# Altium project LimeSDR-XTRX_1v3.PrjPcb (part 6 of 8)

## Sheet 10_Clock.SchDoc: Clock
size A3; Organization: Lime Microsystems; Address1: Surrey Tech Centre; Address2: Guildford GU2 7YG; Address3: Surrey; Address4: United Kingdom; Revision: v1.3; SheetNumber: 10; SheetTotal: 11
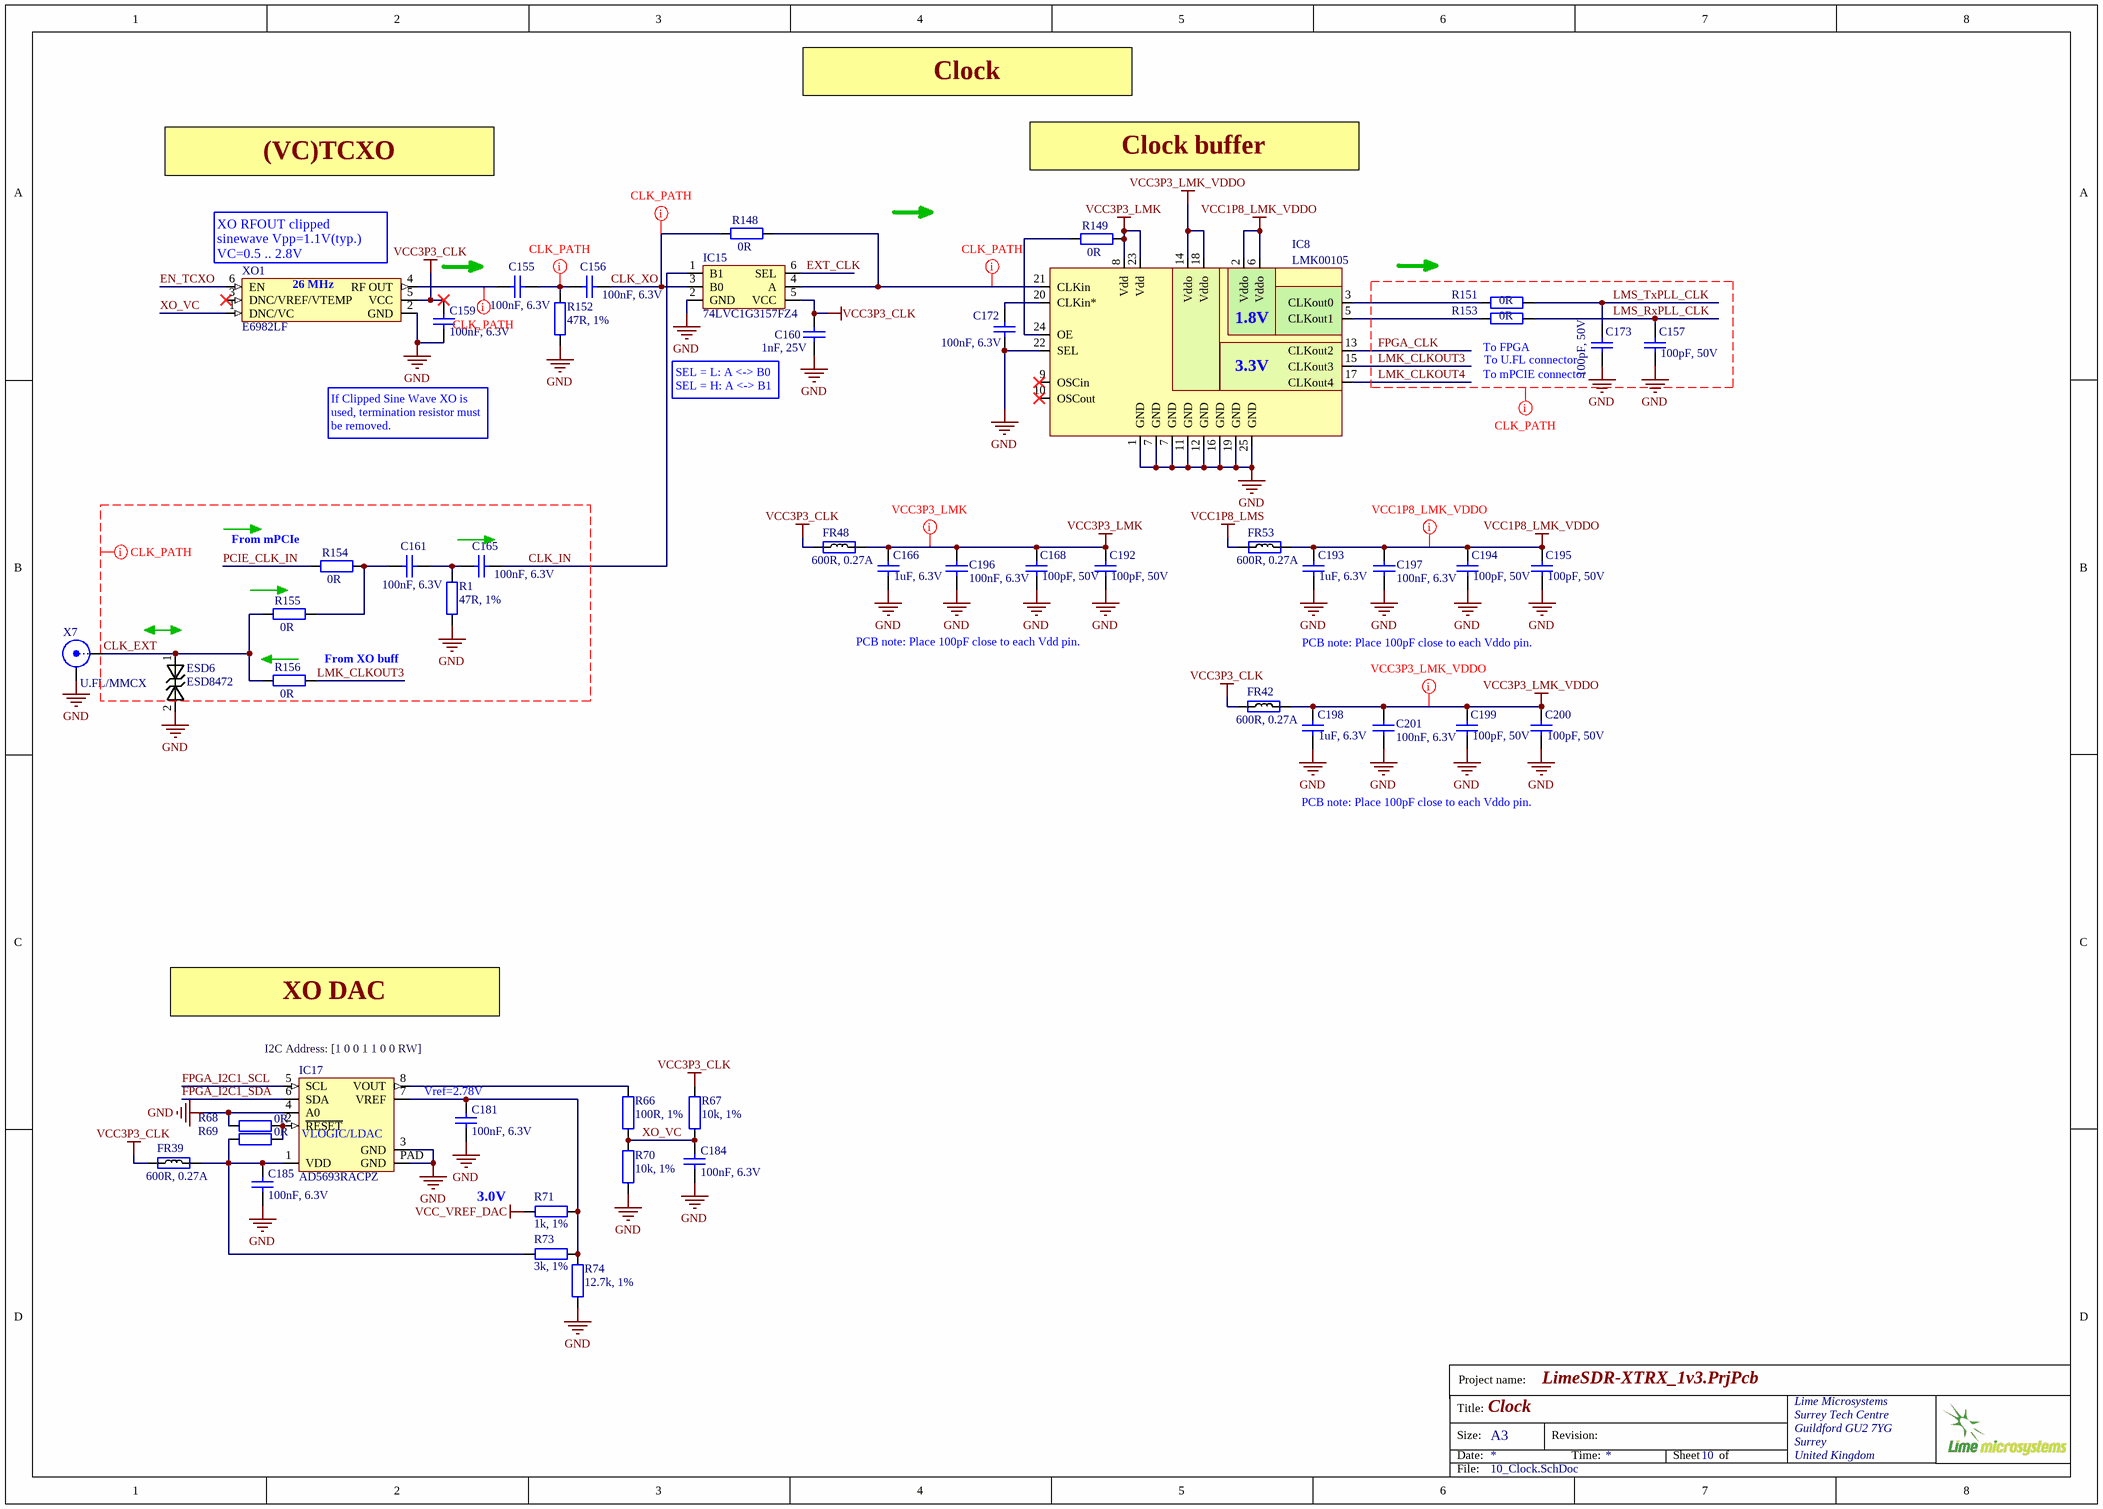
[diagram p9: 10_Clock.SchDoc]

### Parts
C155  100nF, 6.3V  [CAP0201]
C156  100nF, 6.3V  [CAP0201]
C157  100pF, 50V  [CAP0201]
C159  100nF, 6.3V  [CAP0201]
C160  1nF, 25V  [CAP0201]
C161  100nF, 6.3V  [CAP0201]
C165  100nF, 6.3V  [CAP0201]
C166  1uF, 6.3V  [CAP0201]
C168  100pF, 50V  [CAP0201]
C172  100nF, 6.3V  [CAP0201]
C173  100pF, 50V  [CAP0201]
C181  100nF, 6.3V  [CAP0201]
C184  100nF, 6.3V  [CAP0201]
C185  100nF, 6.3V  [CAP0201]
C192  100pF, 50V  [CAP0201]
C193  1uF, 6.3V  [CAP0201]
C194  100pF, 50V  [CAP0201]
C195  100pF, 50V  [CAP0201]
C196  100nF, 6.3V  [CAP0201]
C197  100nF, 6.3V  [CAP0201]
C198  1uF, 6.3V  [CAP0201]
C199  100pF, 50V  [CAP0201]
C200  100pF, 50V  [CAP0201]
C201  100nF, 6.3V  [CAP0201]
ESD6  ESD8472  [ESD8472_X3DFN2]
FR39  600R, 0.27A  [RES0201]
FR42  600R, 0.27A  [RES0201]
FR48  600R, 0.27A  [RES0201]
FR53  600R, 0.27A  [RES0201]
IC8  LMK00105  [LMK00105SQ_v2]
IC15  74LVC1G3157FZ4  [74LVC1G3157FZ4_SPDT_SW_DFN1410-6]
IC17  AD5693RACPZ  [AD5693RACPZ-1RL7_DAC_8LFCSP]
R1  47R, 1%  [RES0201]
R66  100R, 1%  [RES0201]
R67  10k, 1%  [RES0201]
R68  0R  [RES0201]
R69  0R  [RES0201]
R70  10k, 1%  [RES0201]
R71  1k, 1%  [RES0201]
R73  3k, 1%  [RES0201]
R74  12.7k, 1%  [RES0201]
R148  0R  [RES0201]
R149  0R  [RES0201]
R151  0R  [RES0201]
R152  47R, 1%  [RES0201]
R153  0R  [RES0201]
R154  0R  [RES0201]
R155  0R  [RES0201]
R156  0R  [RES0201]
X7  U.FL/MMCX  [MMCX_UFL_conn_u_v2]
XO1  E6982LF  [RAKON_E8231LF_E6982LF]

### Nets
GND: C157.1 C159.2 C160.1 C166.2 C168.1 C172.1 C173.1 C181.2 C184.2 C185.2 C192.1 C193.2 C194.1 C195.1 C196.1 C197.1 C198.2 C199.1 C200.1 C201.1 ESD6.2 IC8.1(GND) IC8.7(GND) IC8.11(GND) IC8.12(GND) IC8.16(GND) IC8.19(GND) IC8.22(SEL) IC8.25(GND) IC15.2(GND) IC17.3(GND) IC17.4(A0) IC17.PAD(GND) R1.2 R68.1 R70.2 R74.2 R152.2 X7.2(Y) XO1.2(GND)
VCC1P8_LMK_VDDO: C193.1 C194.2 C195.2 C197.2 FR53.2 IC8.2(Vddo) IC8.6(Vddo)
VCC1P8_LMS: FR53.1
VCC3P3_CLK: C159.1 C160.2 FR39.1 FR42.1 FR48.1 IC15.5(VCC) R67.1 XO1.5(VCC)
VCC3P3_LMK: C166.1 C168.2 C192.2 C196.2 FR48.2 IC8.8(Vdd) IC8.23(Vdd) R149.2
VCC3P3_LMK_VDDO: C198.1 C199.2 C200.2 C201.2 FR42.2 IC8.14(Vddo) IC8.18(Vddo)
VCC_VREF_DAC: R71.2
CLK_EXT: ESD6.1 R155.1 R156.1 X7.1(X)
CLK_IN: C165.2 IC15.1(B1)
CLK_XO: C156.2 IC15.3(B0) R148.1
EN_TCXO: XO1.6(EN)
EXT_CLK: IC15.6(SEL)
FPGA_CLK: IC8.13(CLKout2)
FPGA_I2C1_SCL: IC17.5(SCL)
FPGA_I2C1_SDA: IC17.6(SDA)
LMK_CLKOUT3: IC8.15(CLKout3) R156.2
LMK_CLKOUT4: IC8.17(CLKout4)
LMS_RxPLL_CLK: C157.2 R153.2
LMS_TxPLL_CLK: C173.2 R151.2
PCIE_CLK_IN: R154.1
XO_VC: C184.1 R66.2 R67.2 R70.1 XO1.1(DNC/VC)
NetC155_1: C155.1 C156.1 R152.1
NetC155_2: C155.2 XO1.4(RF_OUT)
NetC161_1: C161.1 C165.1 R1.1
NetC161_2: C161.2 R154.2 R155.2
NetC172_2: C172.2 IC8.20(CLKin*)
NetC181_1: C181.1 IC17.7(VREF) R71.1 R73.1 R74.1
NetC185_1: C185.1 FR39.2 IC17.1(VDD) R69.1 R73.2
NetIC8_3: IC8.3(CLKout0) R151.1
NetIC8_5: IC8.5(CLKout1) R153.1
NetIC8_21: IC8.21(CLKin) IC15.4(A) R148.2
NetIC8_24: IC8.24(OE) R149.1
NetIC17_2: IC17.2(~{RESET}) R68.2 R69.2
NetIC17_8: IC17.8(VOUT) R66.1

Not connected (* = marked no-connect by the designer): IC8 9(OSCin)* 10(OSCout)*; XO1 3(DNC/VREF/VTEMP)*

### Layout directives
net class CLK_PATH: CLK_EXT, CLK_IN, CLK_XO, FPGA_CLK, GND, LMK_CLKOUT3, LMK_CLKOUT4, LMS_RxPLL_CLK, LMS_TxPLL_CLK, NetC155_1, NetC155_2, NetIC8_21, PCIE_CLK_IN
net class VCC3P3_LMK: VCC3P3_LMK
net class VCC3P3_LMKRF: VCC1P8_LMK_VDDO
net class VCC3P3_LMK_VDDO: VCC3P3_LMK_VDDO

### Notes on the sheet
- Clock
- (VC)TCXO
- Clock buffer
- (near XO1) XO RFOUT clipped sinewave Vpp=1.1V(typ.)
  VC=0.5 .. 2.8V
- (near XO1) 26 MHz
- (near IC8) 3.3V
- (near IC8) 1.8V
- (near C173) To mPCIE connector
- (near R153) To FPGA
- (near C173) To U.FL connector
- If Clipped Sine Wave XO is used, termination resistor must be removed.
- SEL = L: A <-> B0
  SEL = H: A <-> B1
- (near R154) From mPCIe
- PCB note: Place 100pF close to each Vdd pin.
- PCB note: Place 100pF close to each Vddo pin.
- (near R156) From XO buff
- XO DAC
- (near IC17) I2C Address: [1 0 0 1 1 0 0 RW]
- (near C181) Vref=2.78V
- (near IC17) VLOGIC/LDAC
- (near R71) 3.0V
- Project name:
- Title:
- Size:
- Date:
- A3
- Revision:
- Time:
- Sheet
- of
- File:

### Library data of the parts
C155 C156 C161 C165 C172 C196 C197 C201 = Cap_0402: Part Description: 0.1 µF ±20% 10V Ceramic Capacitor X5R 0201 (0603 Metric); Manufacturer: Samsung; Manufacturer Part Number 1: CL03A104MP3NNNC; Tolerance: 20%; Voltage Rating (DC): 10V; Value: 100nF, 6.3V; Capacitance: 100nF; Case/Package: 0201; Case Code (Imperial): 0201; Case Code (Metric): 0603; ComponentLink5Description: https://datasheet.ciiva.com/25788/cl03a104mp3nnnc-25788272.pdf?src-supplier=Digi-Key; ComponentLink5URL: https://datasheet.ciiva.com/25788/cl03a104mp3nnnc-25788272.pdf?src-supplier=Digi-Key; Length: 0.024inch; Max Operating Temperature: 85°C; Min Operating Temperature: -55°C; Mount: Surface Mount; Package Quantity: 1; Packaging: Tape and Reel; Pricing 1: 1=0,10000, 10=0,03000, 50=0,01640, 100=0,01330, 500=0,00950, 1000=0,00747, 2500=0,00679, 5000=0,00625 (USD); RoHS: Yes; RoHS Compliant: Yes; Series: CL; Stock 1: 3817176; Supplier 1: Digi-Key; Supplier Part Number 1: 1276-1321-1-ND; Thickness: 0.013inch; Voltage Rating: 10V; Width: 0.012inch
C157 C168 C173 C192 C194 C195 C199 C200 = Cap_0402: Part Description: 100 pF ±5% 50V Ceramic Capacitor C0G, NP0 0201 (0603 Metric); Manufacturer: TDK; Manufacturer Part Number 1: C0603C0G1H101J030BA; Dielectric Material: Ceramic; Tolerance: 5%; Dielectric: C0G; Insulation Resistance: 10GR; Value: 100pF, 50V; Supplier 1: Digi-Key; Supplier Part Number 1: 445-1786-1-ND; Stock 1: 367528; Pricing 1: 1=0,10000, 10=0,06000, 50=0,03280, 100=0,02670, 500=0,01908, 1000=0,01500, 2500=0,01364, 5000=0,01254 (USD); RoHS: Yes; Mount: Surface Mount; Case/Package: 0201; Number of Pins: 2; Case Code (Metric): 0603; Case Code (Imperial): 0201; Weight: 6E-06oz; Min Operating Temperature: -55°C; Max Operating Temperature: 125°C; Package Quantity: 1; Capacitance: 100pF; Voltage Rating: 50V; Packaging: Tape and Reel; Voltage Rating (DC): 50V; Termination: SMD/SMT; Voltage: 50V; Series: C; Construction: Flat; Length: 0.6mm; Width: 0.012inch; Height: 0.3mm; Thickness: 0.013inch; Depth: 0.3mm; Reach SVHC Compliant: Yes; Lead Free: Lead Free; RoHS Compliant: Yes; ComponentLink1URL: https://datasheet.ciiva.com/24217/c0603c0g1h101j030ba-264106-24217425.pdf?src-supplier=Mouser; ComponentLink1Description: https://datasheet.ciiva.com/24217/c0603c0g1h101j030ba-264106-24217425.pdf?src-supplier=Mouser; ComponentLink2URL: https://datasheet.ciiva.com/16205/mlcc-commercial-general-en-16205590.pdf?src-supplier=Future+Electronics; ComponentLink2Description: https://datasheet.ciiva.com/16205/mlcc-commercial-general-en-16205590.pdf?src-supplier=Future+Electronics; ComponentLink3URL: https://datasheet.ciiva.com/6250/tdkmlcccaprange-6250351.pdf?src-supplier=Digi-Key; ComponentLink3Description: https://datasheet.ciiva.com/6250/tdkmlcccaprange-6250351.pdf?src-supplier=Digi-Key
C159 C181 C184 C185 = Cap_0402: as C95-C97 on sheet 08_FPGA; Value: 100nF, 6.3V; Capacitance: 100nF; Case/Package: 0201; Case Code (Imperial): 0201; Case Code (Metric): 0603; ComponentLink5Description: https://datasheet.ciiva.com/25788/cl03a104mp3nnnc-25788272.pdf?src-supplier=Digi-Key; ComponentLink5URL: https://datasheet.ciiva.com/25788/cl03a104mp3nnnc-25788272.pdf?src-supplier=Digi-Key; Length: 0.024inch; Max Operating Temperature: 85°C; Min Operating Temperature: -55°C; Mount: Surface Mount; Package Quantity: 1; Packaging: Tape and Reel; Pricing 1: 1=0,10000, 10=0,03000, 50=0,01640, 100=0,01330, 500=0,00950, 1000=0,00747, 2500=0,00679, 5000=0,00625 (USD); RoHS: Yes; RoHS Compliant: Yes; Series: CL; Stock 1: 3817176; Supplier 1: Digi-Key; Supplier Part Number 1: 1276-1321-1-ND; Thickness: 0.013inch; Voltage Rating: 10V; Width: 0.012inch
C160 = Cap_0402: as C106 on sheet 08_FPGA; Value: 1nF, 25V; Supplier 1: Digi-Key; Supplier Part Number 1: 445-7275-1-ND; Voltage - Rated: 25V; Features: -; Package / Case: 0201 (0603 Metric); Lead Spacing: -; Mounting Type: Surface Mount, MLCC; Lead Style: -; Height - Seated (Max): -; Operating Temperature: -55°C ~ 125°C; Size / Dimension: 0.024" L x 0.012" W (0.60mm x 0.30mm); Applications: General Purpose; Ratings: -; Thickness (Max): 0.013" (0.33mm); RoHS: RoHS Compliant; Packaging: Cut Tape (CT); Category: Capacitors
C166 C193 C198 = Cap_0402: as C180 on sheet 09_Misc; Supplier 1: Digi-Key; Supplier Part Number 1: 587-5864-2-ND; Applications: General Purpose; Features: -; Lead Style: -; Ratings: -; Thickness (Max): -; Lead Spacing: -; Height - Seated (Max): -; Size / Dimension: 0.024" L x 0.012" W (0.60mm x 0.30mm); Mounting Type: Surface Mount, MLCC; Operating Temperature: -55°C ~ 85°C; Package / Case: 0201 (0603 Metric); Packaging: Cut Tape (CT); Voltage - Rated: 6.3V; Category: Capacitors; RoHS: RoHS Compliant
ESD6 = ESD8472: as ESD5 on sheet 09_Misc; Supplier 1: Digi-Key; RoHS: RoHS Compliant; Category: Circuit Protection; Stock 1: 2295; Pricing 1: 1=0.39, 10=0.315, 100=0.2142, 500=0.16068, 1000=0.12051 (USD); Packaging: Cut Tape (CT); Part Status: Active; Type: Zener; Power - Peak Pulse: -; Applications: Automotive, RF Antenna; Operating Temperature: -55°C ~ 150°C (TJ); Mounting Type: Surface Mount; Package / Case: 2-XFDFN; Supplier Device Package: 2-X3DFN (0.62x0.32); ComponentLink1URL: http://www.onsemi.com/pub/Collateral/ESD8472-D.PDF; ComponentLink1Description: http://www.onsemi.com/pub/Collateral/ESD8472-D.PDF; Supplier Part Number 1: ESD8472MUT5GOSCT-ND
FR39 FR42 FR48 FR53 = Ferrite: as FR36 on sheet 09_Misc; Supplier 1: Digi-Key; Supplier Part Number 1: 587-3277-1-ND; Size / Dimension: 0.024" L x 0.012" W (0.60mm x 0.30mm); Package / Case: 0201 (0603 Metric); Height (Max): 0.013" (0.33mm); Mounting Type: Surface Mount; Packaging: Cut Tape (CT); RoHS: RoHS Compliant; Category: Filters
IC8 = LMK00105: Manufacturer: Texas Instruments; Manufacturer Part Number 1: LMK00105SQ/NOPB; Part Description: IC CLK BUFFER 2:5 200MHZ 24WQFN; Frequency - Max: 200MHz; Voltage - Supply: 2.375 V ~ 3.45 V; Input: HCSL, LVCMOS, LVDS, LVPECL, LVTTL, SSTL, Crystal; Differential - Input:Output: Yes/No; Supplier 1: Digi-Key; Type: Fanout Buffer (Distribution), Multiplexer, Translator; Category: Integrated Circuits (ICs); Operating Temperature: -40°C ~ 85°C; Package / Case: 24-WFQFN Exposed Pad; Supplier Device Package: 24-WQFN (4x4); Supplier Part Number 1: LMK00105SQ/NOPBCT-ND
IC15 = 74LVC1G3157FZ4_SPDT_SW: Part Description: 1 Circuit IC Switch 2:1 10Ohm X2-DFN1410-6; Manufacturer: Diodes; Manufacturer Part Number 1: 74LVC1G3157FZ4-7; Number of Circuits: 1; On-State Resistance: 10R; -3db Bandwidth: 300MHz; Supplier 1: Digi-Key; Supplier Part Number 1: 74LVC1G3157FZ4-7DICT-ND; Stock 1: 158709; Pricing 1: 1=0,42000, 10=0,31200, 25=0,27320, 100=0,17670, 250=0,14628, 500=0,11702, 1000=0,08972, 2500=0,07802 (USD); RoHS: Yes; Number of Pins: 6; Min Operating Temperature: -40°C; Max Operating Temperature: 125°C; Packaging: Tape and Reel; RoHS Compliant: Yes; ComponentLink1URL: https://www.diodes.com/assets/Datasheets/74LVC1G3157.pdf?src-supplier=Digi-Key; ComponentLink1Description: https://www.diodes.com/assets/Datasheets/74LVC1G3157.pdf?src-supplier=Digi-Key; ComponentLink2URL: https://www.diodes.com/assets/product-showcases/74LVC3157-NPA-0516.pdf?src-supplier=Digi-Key; ComponentLink2Description: https://www.diodes.com/assets/product-showcases/74LVC3157-NPA-0516.pdf?src-supplier=Digi-Key
IC17 = AD5693RACPZ-1RL7_DAC: Part Description: 16 Bit Digital to Analog Converter 1 8-LFCSP-UD (2x2); Manufacturer: Analog Devices; Manufacturer Part Number 1: AD5693BCPZ-RL7; Supplier 1: Digikey; Supplier Part Number 1: 505-AD5693BCPZ-RL7CT-ND; Stock 1: 5532; Pricing 1: 1=9,21, 10=6,366, 25=5,6328, 100=4,8123, 250=4,41452, 500=4,17228, 1000=3,97118 (USD); RoHS: Yes; ComponentLink1URL: http://www.mouser.com/ds/2/609/AD5693R_5692R_5691R_5693-534178.pdf?src-supplier=Mouser; ComponentLink1Description: http://www.mouser.com/ds/2/609/AD5693R_5692R_5691R_5693-534178.pdf?src-supplier=Mouser; ComponentLink2URL: https://www.analog.com/media/en/technical-documentation/data-sheets/AD5693R_5692R_5691R_5693.pdf?src-supplier=Digi-Key; ComponentLink2Description: https://www.analog.com/media/en/technical-documentation/data-sheets/AD5693R_5692R_5691R_5693.pdf?src-supplier=Digi-Key; ComponentLink3URL: http://www.analog.com/static/imported-files/data_sheets/AD5693R_5692R_5691R.pdf?src-supplier=Avnet; ComponentLink3Description: http://www.analog.com/static/imported-files/data_sheets/AD5693R_5692R_5691R.pdf?src-supplier=Avnet; ComponentLink4URL: http://www.analog.com/media/en/technical-documentation/data-sheets/AD5693R_5692R_5691R_5693.pdf?src-supplier=Digi-Key; ComponentLink4Description: http://www.analog.com/media/en/technical-documentation/data-sheets/AD5693R_5692R_5691R_5693.pdf?src-supplier=Digi-Key; ComponentLink5Description: https://www.analog.com/media/en/technical-documentation/data-sheets/AD5693R_5692R_5691R_5693.pdf?src-supplier=Digikey; ComponentLink5URL: https://www.analog.com/media/en/technical-documentation/data-sheets/AD5693R_5692R_5691R_5693.pdf?src-supplier=Digikey; ComponentLink6Description: http://www.analog.com/media/en/technical-documentation/data-sheets/AD5693R_5692R_5691R_5693.pdf?src-supplier=Digikey; ComponentLink6URL: http://www.analog.com/media/en/technical-documentation/data-sheets/AD5693R_5692R_5691R_5693.pdf?src-supplier=Digikey; ComponentLink7Description: http://www.analog.com/static/imported-files/data_sheets/AD5693R_5692R_5691R_5693.pdf?src-supplier=Avnet; ComponentLink7URL: http://www.analog.com/static/imported-files/data_sheets/AD5693R_5692R_5691R_5693.pdf?src-supplier=Avnet; ComponentLink8Description: http://www.farnell.com/datasheets/1863077.pdf?src-supplier=Element14; ComponentLink8URL: http://www.farnell.com/datasheets/1863077.pdf?src-supplier=Element14; ComponentLink9Description: https://datasheet.octopart.com/AD5693BCPZ-RL7-Analog-Devices-datasheet-79096046.pdf?src-supplier=Element14; ComponentLink9URL: https://datasheet.octopart.com/AD5693BCPZ-RL7-Analog-Devices-datasheet-79096046.pdf?src-supplier=Element14
R1 R152 = Res_0402: as R72 on sheet 09_Misc; Value: 47R, 1%; Supplier 1: Digi-Key; Supplier Part Number 1: YAG2694CT-ND; Stock 1: 778022; Pricing 1: 1=0,10000, 10=0,03700, 100=0,01530, 1000=0,00685, 2500=0,00595, 5000=0,00491 (USD); RoHS: Yes; Case/Package: 0201; Case Code (Imperial): 0201; Case Code (Metric): 0603; Min Operating Temperature: -55°C; Max Operating Temperature: 125°C; Packaging: Tape and Reel; Resistance: 47R; Tolerance: 1%; Resistor Type: Thick Film; Termination: SMD/SMT; Number of Terminations: 2; Max Power Dissipation: 50mW; Features: Moisture Resistant; Series: RC; Resistance Tolerance: 1%; Length: 0.6mm; Width: 0.3mm; Height: 0.23mm; Reach SVHC Compliant: Yes; RoHS Compliant: Yes; ComponentLink1URL: https://datasheet.ciiva.com/5924/1563626-5924912.pdf?src-supplier=Farnell; ComponentLink1Description: https://datasheet.ciiva.com/5924/1563626-5924912.pdf?src-supplier=Farnell; ComponentLink2URL: https://datasheet.ciiva.com/22661/1563626-22661319.pdf?src-supplier=Element14; ComponentLink2Description: https://datasheet.ciiva.com/22661/1563626-22661319.pdf?src-supplier=Element14
R66 = Res_0402: as R40 on sheet 08_FPGA; ComponentLink1URL: http://www.yageo.com/documents/recent/PYu-RC_Group_51_RoHS_L_7.pdf; ComponentLink1Description: http://www.yageo.com/documents/recent/PYu-RC_Group_51_RoHS_L_7.pdf; Value: 100R, 1%; Supplier 1: Digi-Key; Supplier Part Number 1: 311-100MCT-ND; Stock 1: 1625377; Pricing 1: 1=0,10000, 10=0,03700, 100=0,01530, 1000=0,00685, 2500=0,00595, 5000=0,00491 (USD); RoHS: Yes; Case/Package: 0201; Case Code (Metric): 0603; Case Code (Imperial): 0201; Contact Plating: Tin,Matte; Size Code: 0201; Min Operating Temperature: -55°C; Max Operating Temperature: 125°C; Resistance: 100R; Tolerance: 1%; Packaging: Cut Tape; Package Quantity: 1; Resistor Type: Thick Film; Number of Terminations: 2; Termination: SMD/SMT; Max Power Dissipation: 50mW; Features: Moisture Resistant; Series: RC; Resistance Tolerance: 1%; Length: 0.024inch; Width: 0.012inch; Height: 0.01inch; Radiation Hardening: No; Lead Free: Lead Free; RoHS Compliant: Yes; ComponentLink2URL: https://datasheet.ciiva.com/2560/pyu-r-int-thick-7-2560866.pdf?src-supplier=Digi-Key; ComponentLink2Description: https://datasheet.ciiva.com/2560/pyu-r-int-thick-7-2560866.pdf?src-supplier=Digi-Key; ComponentLink3URL: https://datasheet.ciiva.com/2560/pyu-r-int-thick-7-2560867.pdf?src-supplier=Digi-Key; ComponentLink3Description: https://datasheet.ciiva.com/2560/pyu-r-int-thick-7-2560867.pdf?src-supplier=Digi-Key; ComponentLink4URL: https://datasheet.ciiva.com/2560/pyu-r-int-thick-7-2560865.pdf?src-supplier=Digi-Key; ComponentLink4Description: https://datasheet.ciiva.com/2560/pyu-r-int-thick-7-2560865.pdf?src-supplier=Digi-Key; ComponentLink5URL: https://datasheet.ciiva.com/8887/pyu-rc0201-51-rohs-l-8-8887865.pdf?src-supplier=Avnet; ComponentLink5Description: https://datasheet.ciiva.com/8887/pyu-rc0201-51-rohs-l-8-8887865.pdf?src-supplier=Avnet
R67 R70 = Res_0402: as R34-R36 on sheet 08_FPGA; Value: 10k, 1%; ComponentLink1URL: https://datasheet.ciiva.com/5924/1563626-5924912.pdf?src-supplier=Farnell; ComponentLink1Description: https://datasheet.ciiva.com/5924/1563626-5924912.pdf?src-supplier=Farnell; ComponentLink2URL: https://datasheet.ciiva.com/22661/1563626-22661319.pdf?src-supplier=Element14; ComponentLink2Description: https://datasheet.ciiva.com/22661/1563626-22661319.pdf?src-supplier=Element14; Supplier 1: Digi-Key; Supplier Part Number 1: 311-10.0KMCT-ND; Stock 1: 17142315; Pricing 1: 1=0,10000, 10=0,03700, 100=0,01530, 1000=0,00685, 2500=0,00595, 5000=0,00491 (USD); RoHS: Yes; Case/Package: 0201; Number of Pins: 2; Case Code (Imperial): 0201; Case Code (Metric): 0603; Contact Plating: Tin,Matte; Weight: 6E-06oz; Min Operating Temperature: -55°C; Max Operating Temperature: 125°C; Tolerance: 1%; Packaging: Tape and Reel; Package Quantity: 10000; Termination: SMD/SMT; Resistor Type: Thick Film; Number of Terminations: 2; Max Power Dissipation: 50mW; Voltage Rating (DC): 25V; Features: Moisture Resistant; Series: RC; Resistance Tolerance: 1%; Construction: Rectangular; Working Voltage: 25V; Technology: THICK FILM; Length: 0.6mm; Width: 0.012inch; Height: 0.01inch; Depth: 0.3mm; Radiation Hardening: No; Reach SVHC Compliant: Yes; Military Standard: Not; Lead Free: Lead Free; RoHS Compliant: Yes; ComponentLink3URL: https://datasheet.ciiva.com/7660/1421516-7660807.pdf?src-supplier=Element14; ComponentLink3Description: https://datasheet.ciiva.com/7660/1421516-7660807.pdf?src-supplier=Element14; ComponentLink4URL: https://datasheet.ciiva.com/46391/1421516-46391339.pdf?src-supplier=Element14; ComponentLink4Description: https://datasheet.ciiva.com/46391/1421516-46391339.pdf?src-supplier=Element14; ComponentLink5URL: https://datasheet.ciiva.com/2467/pyu-r-int-thick-7-2467110.pdf?src-supplier=Digi-Key; ComponentLink5Description: https://datasheet.ciiva.com/2467/pyu-r-int-thick-7-2467110.pdf?src-supplier=Digi-Key; ComponentLink6URL: https://datasheet.ciiva.com/2467/pyu-r-int-thick-7-2467111.pdf?src-supplier=Digi-Key; ComponentLink6Description: https://datasheet.ciiva.com/2467/pyu-r-int-thick-7-2467111.pdf?src-supplier=Digi-Key; ComponentLink7URL: https://datasheet.ciiva.com/2467/pyu-r-int-thick-7-2467109.pdf?src-supplier=Digi-Key; ComponentLink7Description: https://datasheet.ciiva.com/2467/pyu-r-int-thick-7-2467109.pdf?src-supplier=Digi-Key
R68 R69 R148 R149 R151 R153-R156 = Res_0402: as R49 on sheet 08_FPGA; ComponentLink1URL: http://www.yageo.com/documents/recent/PYu-RC_Group_51_RoHS_L_7.pdf; ComponentLink1Description: http://www.yageo.com/documents/recent/PYu-RC_Group_51_RoHS_L_7.pdf; Value: 0R; Supplier 1: Digi-Key; Supplier Part Number 1: 311-0.0NCT-ND; Stock 1: 6252381; Pricing 1: 1=0,10000, 10=0,03700, 25=0,02680, 50=0,02020, 100=0,01500, 250=0,01140, 500=0,00912, 1000=0,00672, 5000=0,00482 (USD); RoHS: Yes; Case/Package: 0201; Case Code (Metric): 0603; Case Code (Imperial): 0201; Weight: 6E-06oz; Contact Plating: Tin,Matte; Size Code: 0201; Min Operating Temperature: -55°C; Max Operating Temperature: 125°C; Packaging: Tape and Reel; Resistance: 0R; Package Quantity: 1; Resistor Type: Thick Film; Number of Terminations: 2; Termination: SMD/SMT; Max Power Dissipation: 50mW; Voltage Rating (DC): 25V; Features: Moisture Resistant; Series: RC; Construction: Rectangular; Resistance Tolerance: 5%; Length: 0.024inch; Width: 0.012inch; Height: 0.01inch; Depth: 0.3mm; Radiation Hardening: No; Military Standard: Not; Lead Free: Lead Free; RoHS Compliant: Yes; ComponentLink2URL: https://datasheet.ciiva.com/7672/1563626-7672248.pdf?src-supplier=Element14; ComponentLink2Description: https://datasheet.ciiva.com/7672/1563626-7672248.pdf?src-supplier=Element14; ComponentLink3URL: https://datasheet.ciiva.com/7672/1563626-7672247.pdf?src-supplier=Element14; ComponentLink3Description: https://datasheet.ciiva.com/7672/1563626-7672247.pdf?src-supplier=Element14; ComponentLink4URL: https://datasheet.ciiva.com/7660/1421516-7660808.pdf?src-supplier=Element14; ComponentLink4Description: https://datasheet.ciiva.com/7660/1421516-7660808.pdf?src-supplier=Element14; ComponentLink5URL: https://datasheet.ciiva.com/46391/1421516-46391340.pdf?src-supplier=Element14; ComponentLink5Description: https://datasheet.ciiva.com/46391/1421516-46391340.pdf?src-supplier=Element14
R71 = Res_0402: as R48 on sheet 08_FPGA; Value: 1k, 1%; Supplier 1: Digi-Key; Supplier Part Number 1: 311-1KMDKR-ND; Stock 1: 9099863; Pricing 1: 1=0,10000, 10=0,03700, 100=0,01530, 1000=0,00685, 2500=0,00595, 5000=0,00491 (USD); RoHS: Yes; Case/Package: 0201; Case Code (Metric): 0603; Case Code (Imperial): 0201; Contact Plating: Tin,Matte; Min Operating Temperature: -55°C; Max Operating Temperature: 125°C; Package Quantity: 10000; Packaging: Tape and Reel; Tolerance: 1%; Resistor Type: Thick Film; Number of Terminations: 2; Termination: SMD/SMT; Max Power Dissipation: 50mW; Working Voltage: 25V; Features: Moisture Resistant; Series: RC; Resistance Tolerance: 1%; Technology: THICK FILM; Construction: Rectangular; Length: 0.024inch; Width: 0.012inch; Height: 0.01inch; Depth: 0.3mm; Radiation Hardening: No; Military Standard: Not; Lead Free: Lead Free; RoHS Compliant: Yes; ComponentLink1URL: https://datasheet.ciiva.com/7672/1563626-7672204.pdf?src-supplier=Element14; ComponentLink1Description: https://datasheet.ciiva.com/7672/1563626-7672204.pdf?src-supplier=Element14; ComponentLink2URL: https://datasheet.ciiva.com/22698/1563626-22698505.pdf?src-supplier=Element14; ComponentLink2Description: https://datasheet.ciiva.com/22698/1563626-22698505.pdf?src-supplier=Element14; ComponentLink3URL: https://datasheet.ciiva.com/29721/pyu-r-int-thick-7-29721196.pdf?src-supplier=Digi-Key; ComponentLink3Description: https://datasheet.ciiva.com/29721/pyu-r-int-thick-7-29721196.pdf?src-supplier=Digi-Key; ComponentLink4URL: https://datasheet.ciiva.com/29721/pyu-r-int-thick-7-29721195.pdf?src-supplier=Digi-Key; ComponentLink4Description: https://datasheet.ciiva.com/29721/pyu-r-int-thick-7-29721195.pdf?src-supplier=Digi-Key; ComponentLink5URL: https://datasheet.ciiva.com/8896/pyu-rc0201-51-rohs-l-8-8896174.pdf?src-supplier=Avnet; ComponentLink5Description: https://datasheet.ciiva.com/8896/pyu-rc0201-51-rohs-l-8-8896174.pdf?src-supplier=Avnet
R73 = Res_0402: as R46 on sheet 08_FPGA; Value: 3k, 1%; Supplier 1: Digi-Key; Supplier Part Number 1: YAG2656CT-ND; Stock 1: 269780; Pricing 1: 1=0,10000, 10=0,03700, 100=0,01530, 1000=0,00685, 2500=0,00595, 5000=0,00491 (USD); RoHS: Yes; Case/Package: 0201; Case Code (Metric): 0603; Case Code (Imperial): 0201; Min Operating Temperature: -55°C; Max Operating Temperature: 125°C; Packaging: Tape and Reel; Resistor Type: Thick Film; Number of Terminations: 2; Tolerance: 1%; Features: Moisture Resistant; Length: 0.024inch; Width: 0.012inch; Height: 0.01inch; RoHS Compliant: Yes; ComponentLink1URL: http://www.yageo.com/documents/recent/PYu-RC_Group_51_RoHS_L_10.pdf?src-supplier=Digi-Key; ComponentLink1Description: http://www.yageo.com/documents/recent/PYu-RC_Group_51_RoHS_L_10.pdf?src-supplier=Digi-Key; ComponentLink2URL: http://www.yageo.com.tw/exep/pages/download/literatures/PYu-R_INT-thick_7.pdf?src-supplier=Digi-Key; ComponentLink2Description: http://www.yageo.com.tw/exep/pages/download/literatures/PYu-R_INT-thick_7.pdf?src-supplier=Digi-Key; ComponentLink3URL: http://www.yageo.com/documents/recent/PYu-RC_Group_51_RoHS_L_9.pdf?src-supplier=Digi-Key; ComponentLink3Description: http://www.yageo.com/documents/recent/PYu-RC_Group_51_RoHS_L_9.pdf?src-supplier=Digi-Key
R74 = Res_0402: Manufacturer: Yageo; Manufacturer Part Number 1: RC0201FR-0712K7L; Part Description: 12.7 kOhms ±1% 0.05W, 1/20W Chip Resistor 0201 (0603 Metric) Moisture Resistant Thick Film; Resistance: 12.7kR; Temperature Coefficient: 200ppm/°C; Max Power Dissipation: 50mW; Value: 12.7k, 1%; ComponentLink1URL: https://datasheet.ciiva.com/5924/1563626-5924912.pdf?src-supplier=Farnell; ComponentLink1Description: https://datasheet.ciiva.com/5924/1563626-5924912.pdf?src-supplier=Farnell; ComponentLink2URL: https://datasheet.ciiva.com/22661/1563626-22661319.pdf?src-supplier=Element14; ComponentLink2Description: https://datasheet.ciiva.com/22661/1563626-22661319.pdf?src-supplier=Element14; ComponentLink3URL: https://datasheet.ciiva.com/7660/1421516-7660807.pdf?src-supplier=Element14; ComponentLink3Description: https://datasheet.ciiva.com/7660/1421516-7660807.pdf?src-supplier=Element14; ComponentLink4URL: https://datasheet.ciiva.com/46391/1421516-46391339.pdf?src-supplier=Element14; ComponentLink4Description: https://datasheet.ciiva.com/46391/1421516-46391339.pdf?src-supplier=Element14; ComponentLink5URL: https://datasheet.ciiva.com/2467/pyu-r-int-thick-7-2467110.pdf?src-supplier=Digi-Key; ComponentLink5Description: https://datasheet.ciiva.com/2467/pyu-r-int-thick-7-2467110.pdf?src-supplier=Digi-Key; ComponentLink6URL: https://datasheet.ciiva.com/2467/pyu-r-int-thick-7-2467111.pdf?src-supplier=Digi-Key; ComponentLink6Description: https://datasheet.ciiva.com/2467/pyu-r-int-thick-7-2467111.pdf?src-supplier=Digi-Key; ComponentLink7URL: https://datasheet.ciiva.com/2467/pyu-r-int-thick-7-2467109.pdf?src-supplier=Digi-Key; ComponentLink7Description: https://datasheet.ciiva.com/2467/pyu-r-int-thick-7-2467109.pdf?src-supplier=Digi-Key; Supplier 1: Digi-Key; Supplier Part Number 1: 311-12.7KMCT-ND; Stock 1: 49027; Pricing 1: 1=0,10000, 10=0,03700, 100=0,01500, 1000=0,00672, 2500=0,00583, 5000=0,00482 (USD); RoHS: Yes; Case/Package: 0201; Case Code (Metric): 0603; Case Code (Imperial): 0201; Min Operating Temperature: -55°C; Max Operating Temperature: 125°C; Package Quantity: 1; Tolerance: 1%; Packaging: Tape and Reel; Resistor Type: Thick Film; Number of Terminations: 2; Features: Moisture Resistant; Series: RC; Length: 0.024inch; Width: 0.012inch; Height: 0.01inch; RoHS Compliant: Yes; ComponentLink8URL: https://datasheet.ciiva.com/2493/pyu-r-int-thick-7-2493806.pdf?src-supplier=Digi-Key; ComponentLink8Description: https://datasheet.ciiva.com/2493/pyu-r-int-thick-7-2493806.pdf?src-supplier=Digi-Key; ComponentLink9URL: https://datasheet.ciiva.com/2493/pyu-r-int-thick-7-2493807.pdf?src-supplier=Digi-Key; ComponentLink9Description: https://datasheet.ciiva.com/2493/pyu-r-int-thick-7-2493807.pdf?src-supplier=Digi-Key; ComponentLink10URL: https://datasheet.ciiva.com/2493/pyu-r-int-thick-7-2493805.pdf?src-supplier=Digi-Key; ComponentLink10Description: https://datasheet.ciiva.com/2493/pyu-r-int-thick-7-2493805.pdf?src-supplier=Digi-Key
X7 = RF_IF_connector: as X5 on sheet 09_Misc; Cable Group: -; Category: Connectors, Interconnects; Fastening Type: Snap-On; Features: -; Housing Color: Silver; Ingress Protection: -; Mounting Type: Surface Mount; Operating Temperature: -40°C ~ 90°C; Packaging: Cut Tape (CT); RoHS: RoHS Compliant; Shield Termination: Solder; Supplier 1: Digi-Key; Supplier Part Number 1: WM5587CT-ND
XO1 = RAKON_E8231LF_E6982LF: Part Description: 26MHz E6982LF Small Cell TCVCXO, w EN and VC, L x W: 5.0 x 3.2 mm nom., H: 2.1 mm max. (6 pad); Manufacturer: Rakon; Manufacturer Part Number 1: E6982LF; Supplier Part Number 1: E6982LF; Supplier 1: Rakon